# Altium schematic sheet SCNano-Geig.SchDoc: SCNano Geiger Assy
size B; Engineer: Joseph Chiu; Organization: ToyBuilder Labs; Address1: 2736 E Walnut St; Address2: Pasadena, California 91107; Address4: +1 (626) 808-4010
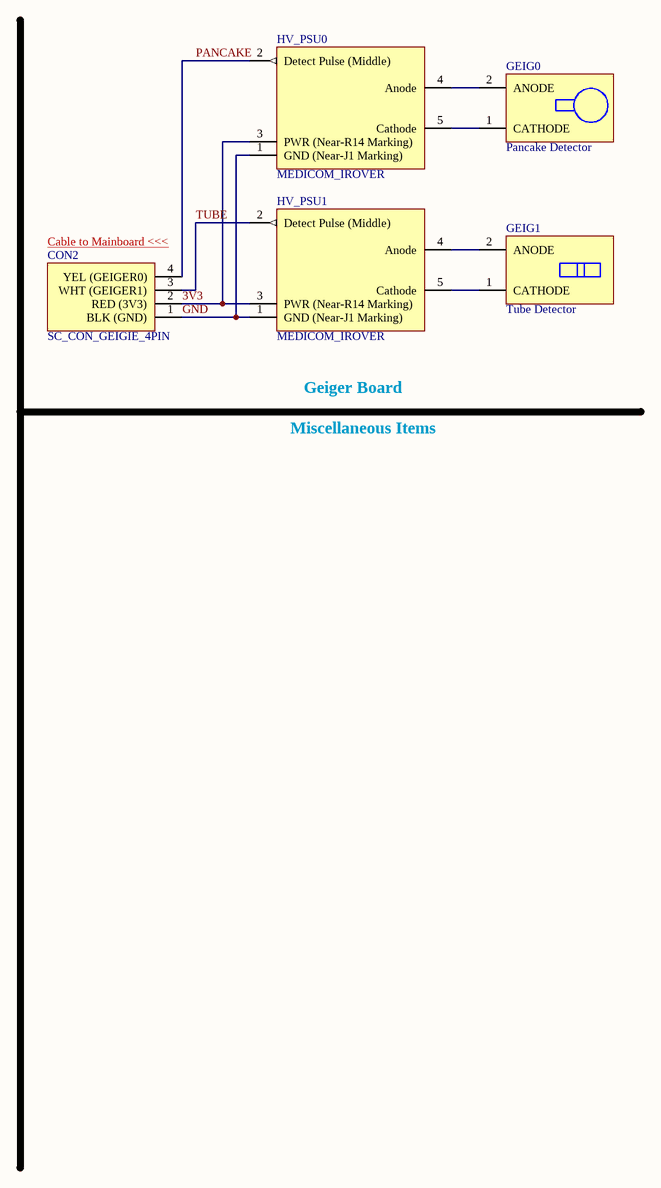
[diagram p0: SCNano-Geig.SchDoc]

## Parts
CON2  SC_CON_GEIGIE_4PIN  [NSTECH 1125S]
GEIG0  Pancake Detector
GEIG1  Tube Detector
HV_PSU0  MEDICOM_IROVER  [IROVER_HV]
HV_PSU1  MEDICOM_IROVER  [IROVER_HV]

## Nets
3V3: CON2.2(RED_(3V3)) HV_PSU0.3(PWR_(Near-R14_Marking)) HV_PSU1.3(PWR_(Near-R14_Marking))
GND: CON2.1(BLK_(GND)) HV_PSU0.1(GND_(Near-J1_Marking)) HV_PSU1.1(GND_(Near-J1_Marking))
PANCAKE: CON2.4(YEL_(GEIGER0)) HV_PSU0.2(Detect_Pulse_(Middle))
TUBE: CON2.3(WHT_(GEIGER1)) HV_PSU1.2(Detect_Pulse_(Middle))
NetGEIG0_1: GEIG0.1(CATHODE) HV_PSU0.5(Cathode)
NetGEIG0_2: GEIG0.2(ANODE) HV_PSU0.4(Anode)
NetGEIG1_1: GEIG1.1(CATHODE) HV_PSU1.5(Cathode)
NetGEIG1_2: GEIG1.2(ANODE) HV_PSU1.4(Anode)

## Notes on the sheet
- (near CON2) Cable to Mainboard <<<
- Geiger Board
- Miscellaneous Items
- Title
- Size:
- Date:
- B
- Number:
- Time:
- Revision:
- Sheet
- of
- File:

## Library data of the parts
CON2 = SC_CON_GEIGIE_4PIN: Grove 4 Pin Connector Female T/H, labeled for Safecast Geiegie products; Manufacturer: Grove; Manufacturer Part Number: 4 Pin Connector
GEIG0 = LND_7318: LND 7318 Pancake Geiger Tube; Manufacturer Part Number: 7317; ComponentLink1Description: Product Page; ComponentLink1URL: http://www.lndinc.com/products/17/; Manufacturer: LND
GEIG1 = LND_7128: LND 7128 Energy-Compensated Geiger Tube; Manufacturer Part Number: 7128; ComponentLink1Description: Product Page; ComponentLink1URL: http://www.lndinc.com/products/353/; Manufacturer: LND
HV_PSU0 HV_PSU1 = MEDICOM_IROVER: International Medcom iRover High-Voltage Power Supply and Counter Module; Manufacturer Part Number: IRover PSU; Manufacturer: Medicom; ComponentLink1Description: Supplier Website; ComponentLink1URL: https://medcom.com/